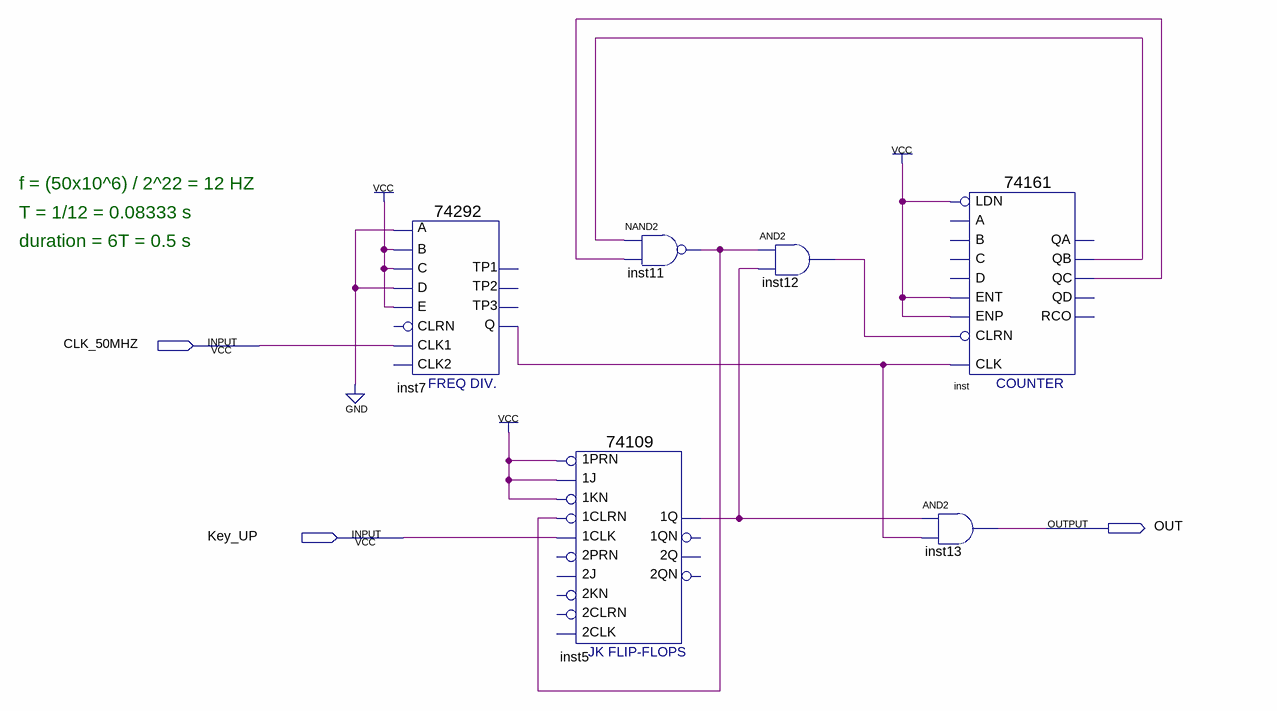
[diagram p0: schematic sheet]
// Quartus schematic duration_flask_500ms.bdf as structural Verilog: 6 symbols, 3 pins
module duration_flask_500ms (
  input  CLK_50MHZ,
  input  Key_UP,
  output OUT
);

  wire inst5_1q, inst7_q, inst11_out, inst12_out, inst_qb, inst_qc;

  \74292  inst7 (
    .A(1'b0), .D(1'b0), .C(1'b1), .B(1'b1), .CLK1(CLK_50MHZ), .E(1'b1), .Q(inst7_q));  // open: CLRN, CLK2, TP2, TP1, TP3
  nand inst11 (inst11_out, inst_qb, inst_qc);
  \74109  inst5 (
    .\1J (1'b1), .\1PRN (1'b1), .\1KN (1'b1), .\1CLK (Key_UP), .\1CLRN (inst11_out), .\1Q (inst5_1q));  // open: 2PRN, 2J, 2KN, 2CLRN, 2CLK, 2Q, 2QN, 1QN
  and inst12 (inst12_out, inst11_out, inst5_1q);
  and inst13 (OUT, inst5_1q, inst7_q);
  \74161  inst (
    .CLRN(inst12_out), .CLK(inst7_q), .ENP(1'b1), .LDN(1'b1), .ENT(1'b1), .QC(inst_qc), .QB(inst_qb));  // open: A, D, B, C, QD, QA, RCO

  // Notes on the sheet:
  //   f = (50x10^6) / 2^22 = 12 HZ
  //   T = 1/12 = 0.08333 s
  //   duration = 6T = 0.5 s
endmodule
